# Altium schematic sheet MCU.SchDoc
size 304 x 254 mm
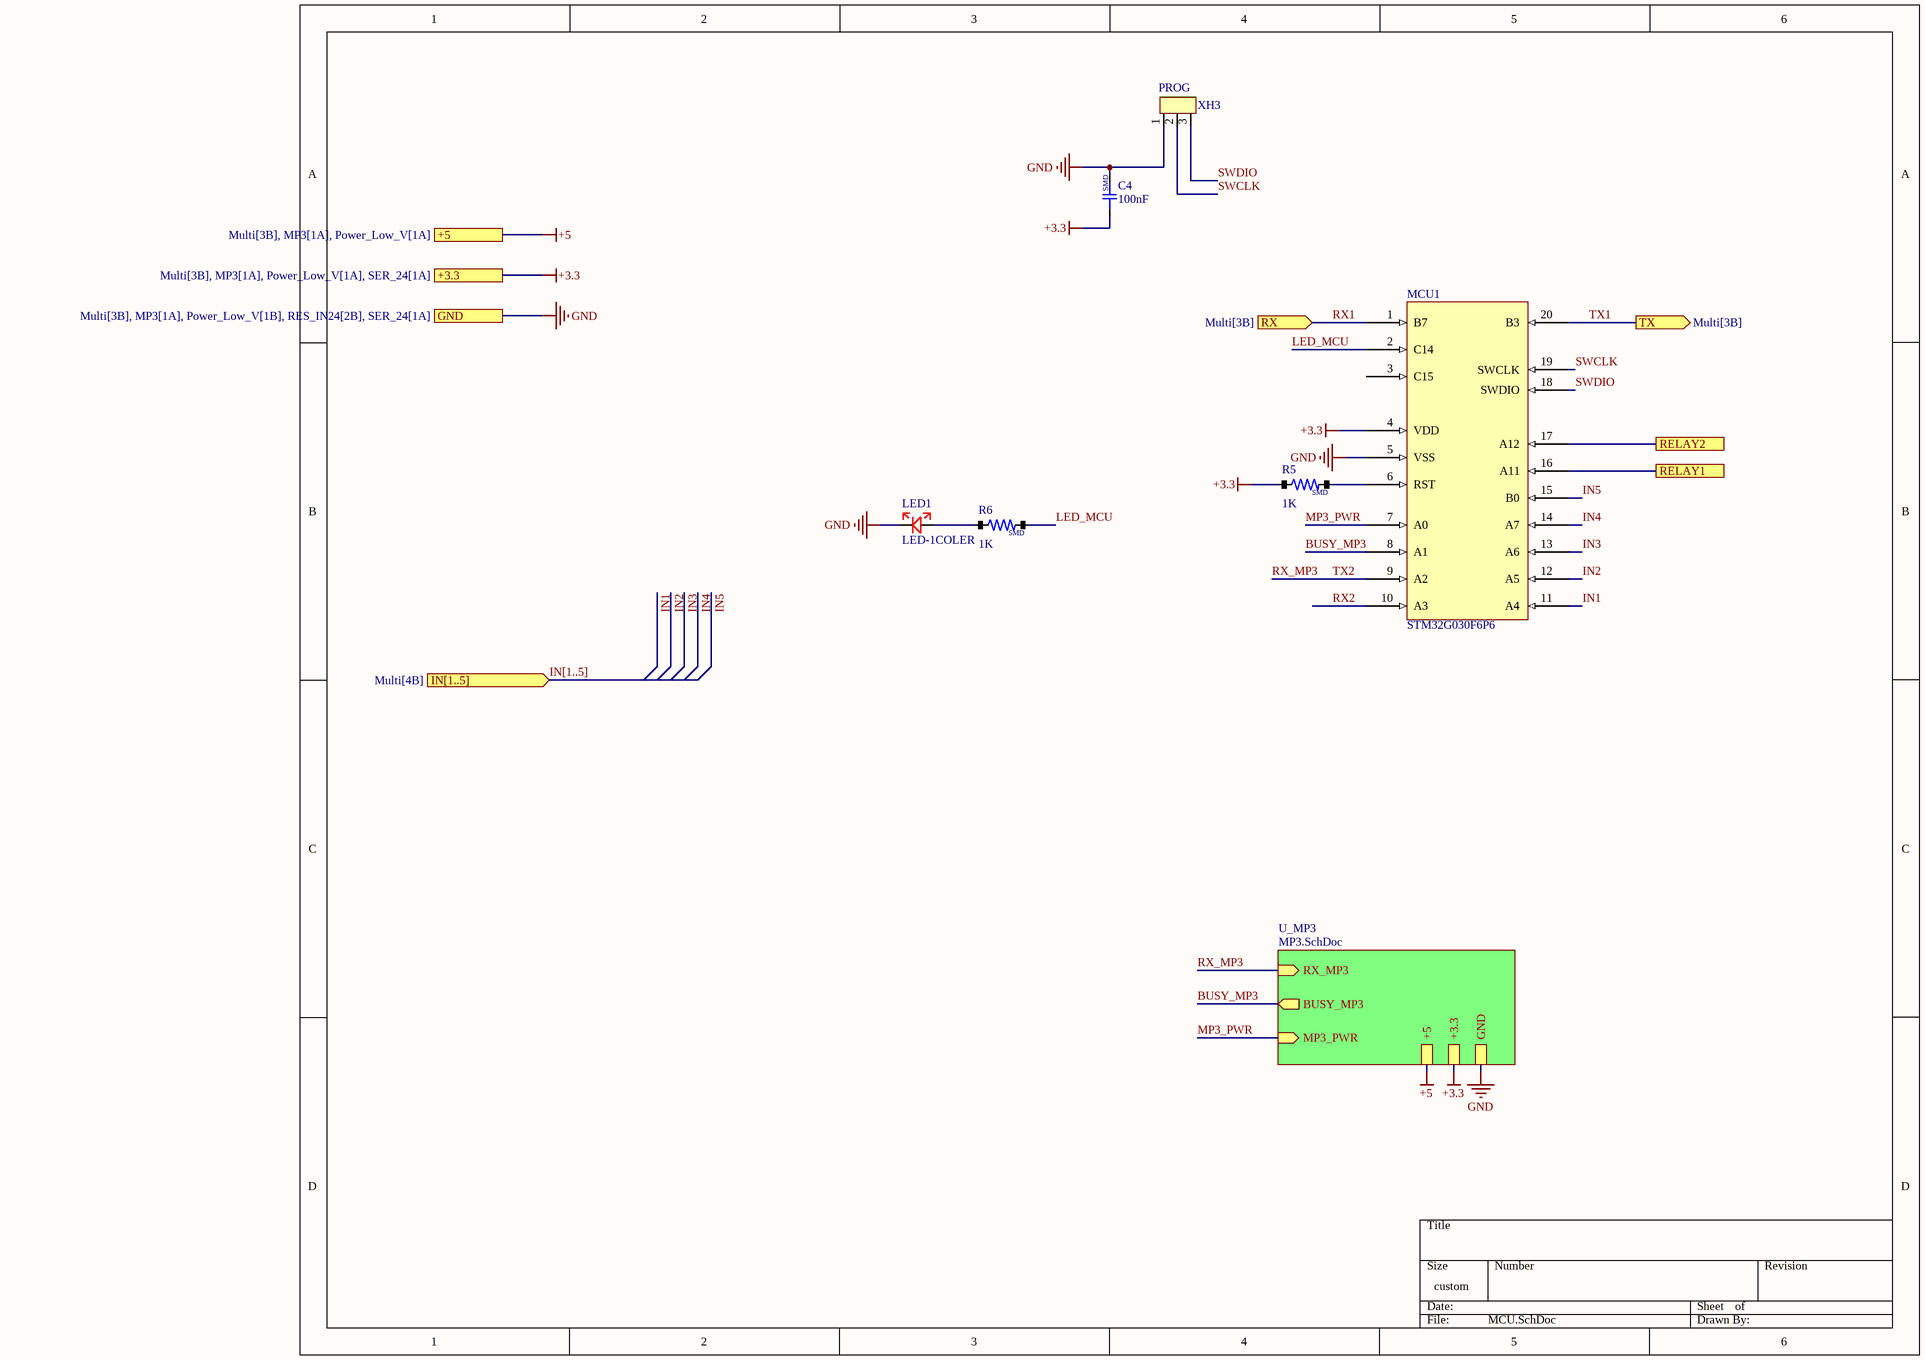
[diagram p0: MCU.SchDoc]

## Parts
C4  100nF  [CAP-0603]
LED1  LED-1COLER  [LED/0805]
MCU1  STM32G030F6P6  [stm32G030F6P6]
PROG  XH3  [XH3]
R5  1K  [RES/0603]
R6  1K  [RES/0603]

## Sub-sheets
U_MP3 = MP3.SchDoc: +3.3, GND, +5, MP3_PWR (in), RX_MP3 (in), BUSY_MP3 (out)

## Ports
+3.3 (see Multi[3B], MP3[1A], Power_Low_V[1A], SER_24[1A]), +5 (see Multi[3B], MP3[1A], Power_Low_V[1A]), GND (see Multi[3B], MP3[1A], Power_Low_V[1B], RES_IN24[2B], SER_24[1A]), IN[1..5] (in, see Multi[4B]), RELAY1, RELAY2, RX (in, see Multi[3B]), TX (out, see Multi[3B])

## Nets
+3.3: C4.1 MCU1.4(VDD) R5.1 ; port +3.3, sheet U_MP3/+3.3
+5: port +5, sheet U_MP3/+5
GND: C4.2 LED1.K MCU1.5(VSS) PROG.1 ; port GND, sheet U_MP3/GND
BUSY_MP3: MCU1.8(A1) ; sheet U_MP3/BUSY_MP3
IN1: MCU1.11(A4)
IN2: MCU1.12(A5)
IN3: MCU1.13(A6)
IN4: MCU1.14(A7)
IN5: MCU1.15(B0)
LED_MCU: MCU1.2(C14) R6.2
MP3_PWR: MCU1.7(A0) ; sheet U_MP3/MP3_PWR
RELAY1: MCU1.16(A11) ; port RELAY1
RELAY2: MCU1.17(A12) ; port RELAY2
RX1: MCU1.1(B7) ; port RX
RX2: MCU1.10(A3)
RX_MP3: MCU1.9(A2) ; sheet U_MP3/RX_MP3  [also labelled TX2]
SWCLK: MCU1.19(SWCLK) PROG.2
SWDIO: MCU1.18(SWDIO) PROG.3
TX1: MCU1.20(B3) ; port TX
NetLED1_A: LED1.A R6.1
NetMCU1_6: MCU1.6(RST) R5.2

Not connected (* = marked no-connect by the designer): MCU1 3(C15)

## Buses and harness runs
bus IN[1..5] = port IN[1..5]

## Notes on the sheet
- (in symbol cap_smd) SMD
- (in symbol RES/SMD) SMD

## Library data of the parts
C4 = cap_smd
R5 R6 = RES/SMD